# Altium project 8 step seq SMT.PrjPcb
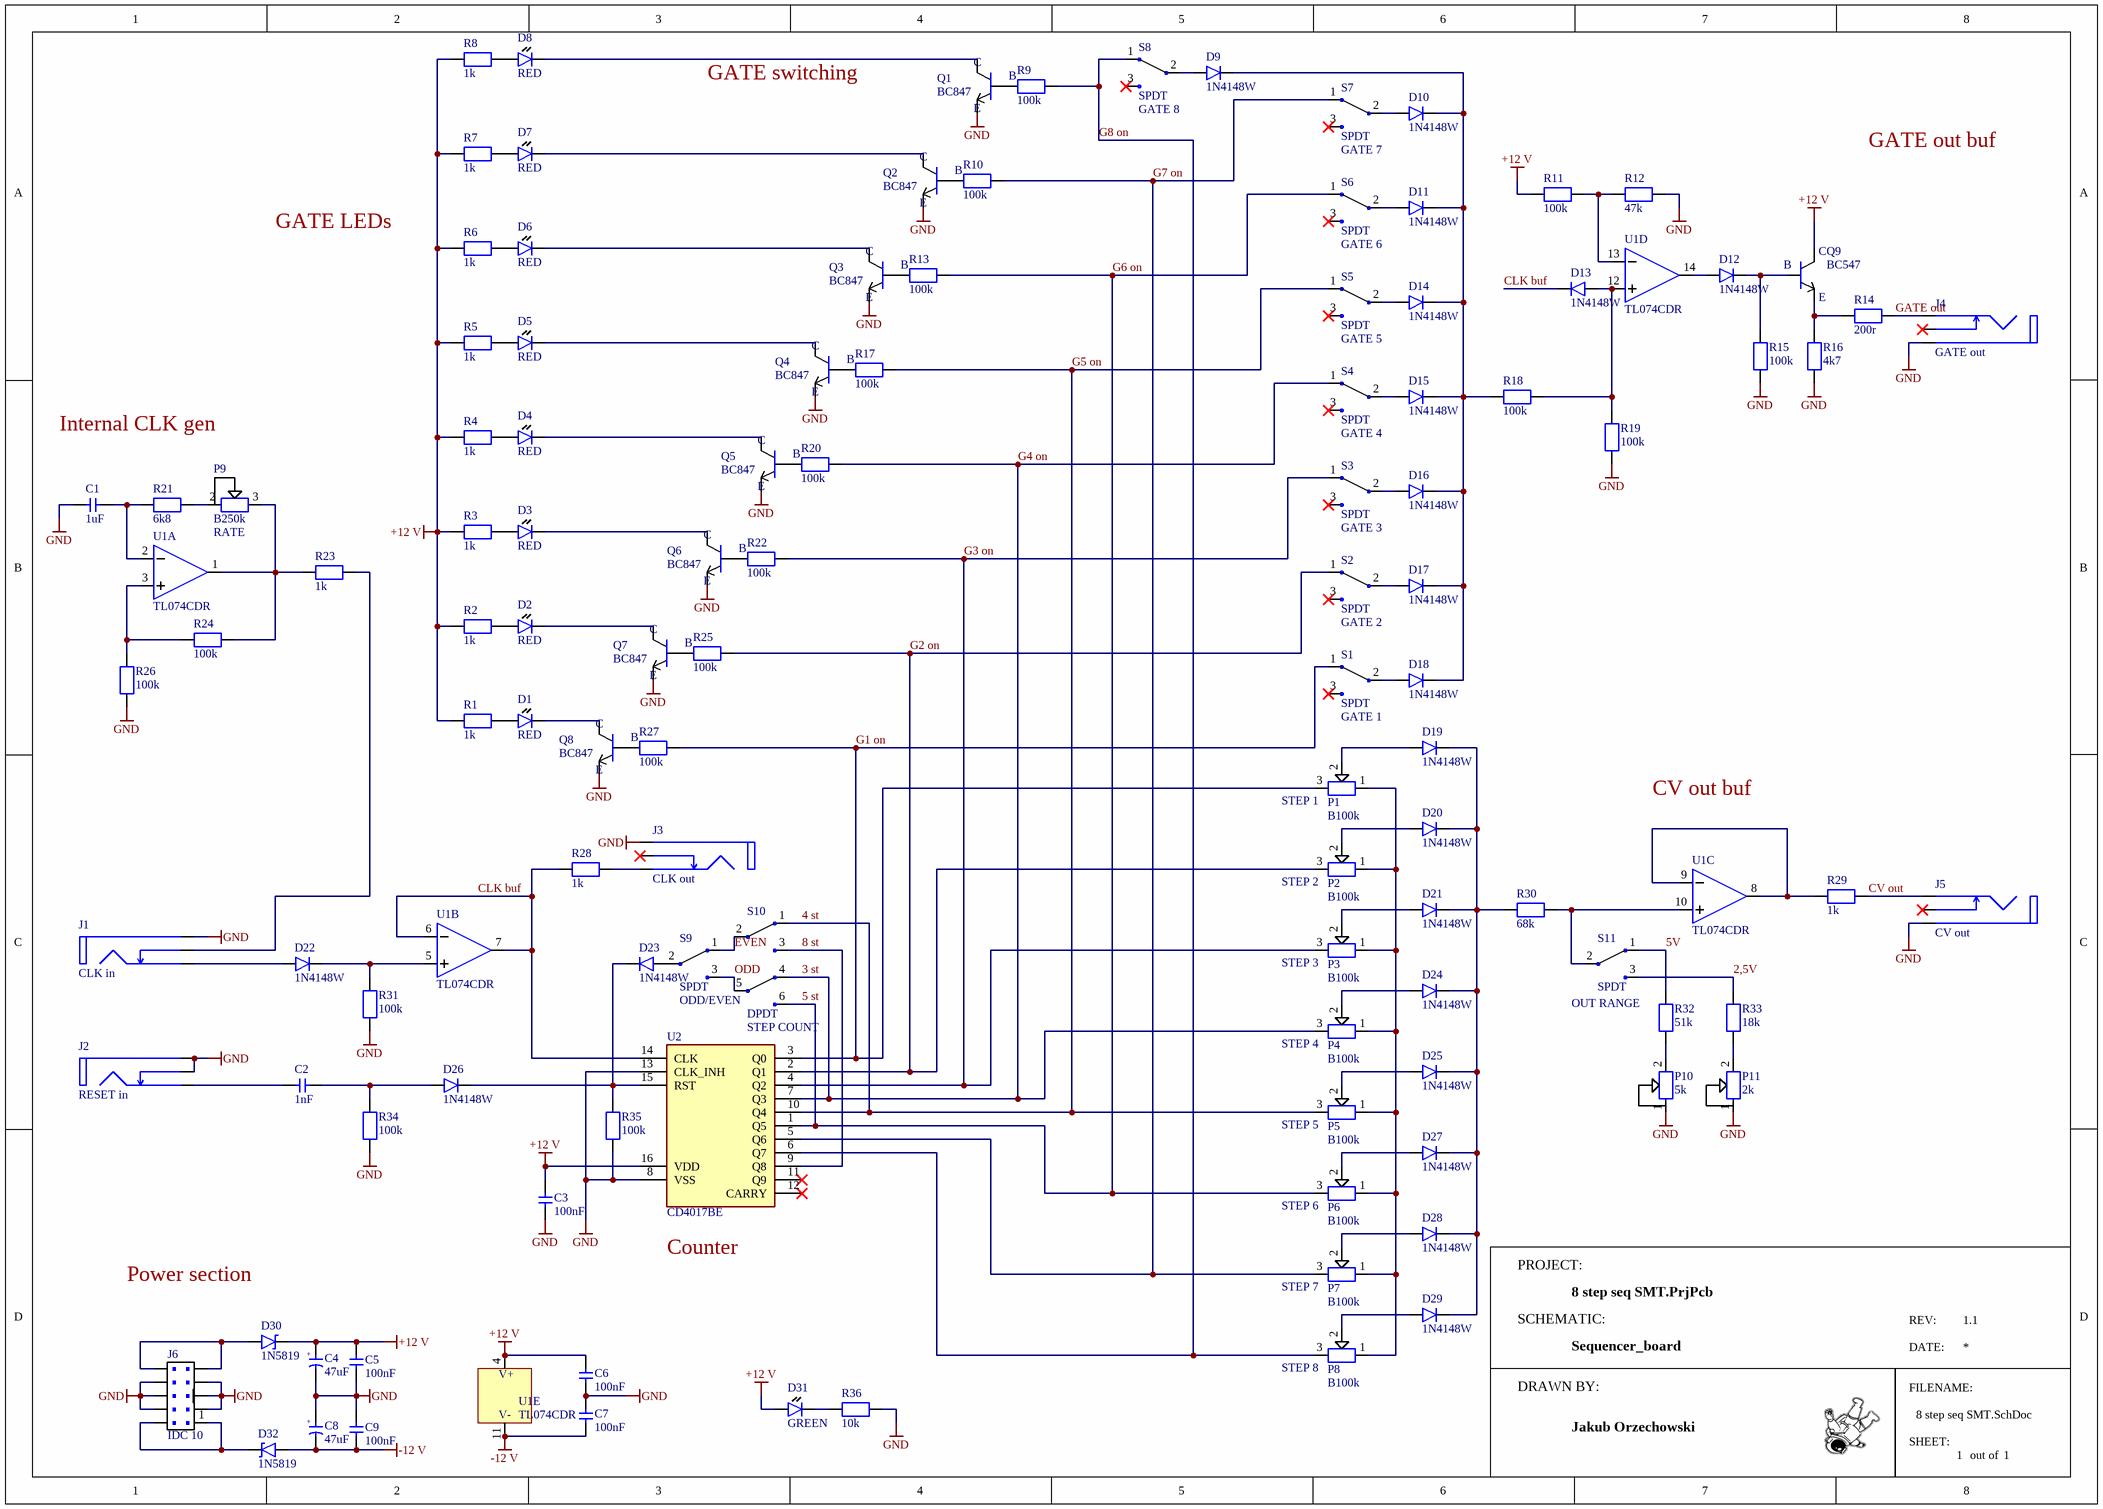
[diagram p0: 8 step seq SMT.SchDoc]
1 sheet, 116 parts. Net scope: global (net labels, ports and power ports of the same name join across sheets).
Board file: 8 step seq SMT.PcbDoc

## Sheet 8 step seq SMT.SchDoc: Sequencer_board
size A3; Author: Jakub Orzechowski; DrawnBy: Jakub Orzechowski; Engineer: aa; Revision: 1.1; SheetNumber: 1; SheetTotal: 1

### Parts
C1  value 1uF  [Cap SMD 0805]  (hidden comment: CAP)
C2  value 1nF  [Cap SMD 0805]  (hidden comment: CAP)
C3  value 100nF  [Cap SMD 0805]  (hidden comment: CAP)
C4  value 47uF  [Cap electrolytic THT 5mm]  (hidden comment: CAP)
C5  value 100nF  [Cap SMD 0805]  (hidden comment: CAP)
C6  value 100nF  [Cap SMD 0805]  (hidden comment: CAP)
C7  value 100nF  [Cap SMD 0805]  (hidden comment: CAP)
C8  value 47uF  [Cap electrolytic THT 5mm]  (hidden comment: CAP)
C9  value 100nF  [Cap SMD 0805]  (hidden comment: CAP)
D1  Color: RED  [LED THT 3 mm raised]  (hidden comment: LED)
D2  Color: RED  [LED THT 3 mm raised]  (hidden comment: LED)
D3  Color: RED  [LED THT 3 mm raised]  (hidden comment: LED)
D4  Color: RED  [LED THT 3 mm raised]  (hidden comment: LED)
D5  Color: RED  [LED THT 3 mm raised]  (hidden comment: LED)
D6  Color: RED  [LED THT 3 mm raised]  (hidden comment: LED)
D7  Color: RED  [LED THT 3 mm raised]  (hidden comment: LED)
D8  Color: RED  [LED THT 3 mm raised]  (hidden comment: LED)
D9  DIODE  [SOD-123]  (value not drawn)
D10  DIODE  [SOD-123]  (value not drawn)
D11  DIODE  [SOD-123]  (value not drawn)
D12  DIODE  [SOD-123]  (value not drawn)
D13  DIODE  [SOD-123]  (value not drawn)
D14  DIODE  [SOD-123]  (value not drawn)
D15  DIODE  [SOD-123]  (value not drawn)
D16  DIODE  [SOD-123]  (value not drawn)
D17  DIODE  [SOD-123]  (value not drawn)
D18  DIODE  [SOD-123]  (value not drawn)
D19  DIODE  [SOD-123]  (value not drawn)
D20  DIODE  [SOD-123]  (value not drawn)
D21  DIODE  [SOD-123]  (value not drawn)
D22  DIODE  [SOD-123]  (value not drawn)
D23  DIODE  [SOD-123]  (value not drawn)
D24  DIODE  [SOD-123]  (value not drawn)
D25  DIODE  [SOD-123]  (value not drawn)
D26  DIODE  [SOD-123]  (value not drawn)
D27  DIODE  [SOD-123]  (value not drawn)
D28  DIODE  [SOD-123]  (value not drawn)
D29  DIODE  [SOD-123]  (value not drawn)
D30  Model: 1N5819  [Diode THT 10 mm]  (hidden comment: SCHOTTKY)
D31  Color: GREEN  [LED SMD 0805]  (hidden comment: LED)
D32  Model: 1N5819  [Diode THT 10 mm]  (hidden comment: SCHOTTKY)
J1  Label: CLK in  [PJ301M]  (hidden comment: JACK Mono)
J2  Label: RESET in  [PJ301M]  (hidden comment: JACK Mono)
J3  Label: CLK out  [PJ301M]  (hidden comment: JACK Mono)
J4  Label: GATE out  [PJ301M]  (hidden comment: JACK Mono)
J5  Label: CV out  [PJ301M]  (hidden comment: JACK Mono)
J6  IDC 10  [IDC 10 PIN]
P1  value B100k  Parameter: STEP 1  [9 mm PCB Potentiometer]  (hidden comment: Mono Pot)
P2  value B100k  Parameter: STEP 2  [9 mm PCB Potentiometer]  (hidden comment: Mono Pot)
P3  value B100k  Parameter: STEP 3  [9 mm PCB Potentiometer]  (hidden comment: Mono Pot)
P4  value B100k  Parameter: STEP 4  [9 mm PCB Potentiometer]  (hidden comment: Mono Pot)
P5  value B100k  Parameter: STEP 5  [9 mm PCB Potentiometer]  (hidden comment: Mono Pot)
P6  value B100k  Parameter: STEP 6  [9 mm PCB Potentiometer]  (hidden comment: Mono Pot)
P7  value B100k  Parameter: STEP 7  [9 mm PCB Potentiometer]  (hidden comment: Mono Pot)
P8  value B100k  Parameter: STEP 8  [9 mm PCB Potentiometer]  (hidden comment: Mono Pot)
P9  value B250k  Parameter: RATE  [9 mm PCB Potentiometer]  (hidden comment: VR)
P10  value 5k  [Multiturn Potentiometer inline]  (hidden comment: VR)
P11  value 2k  [Multiturn Potentiometer inline]  (hidden comment: VR)
Q1  BC847  [SOT-23-3]
Q2  BC847  [SOT-23-3]
Q3  BC847  [SOT-23-3]
Q4  BC847  [SOT-23-3]
Q5  BC847  [SOT-23-3]
Q6  BC847  [SOT-23-3]
Q7  BC847  [SOT-23-3]
Q8  BC847  [SOT-23-3]
Q9  BC547  [TO-92 wide]
R1  value 1k  [Resistor SMD 0805]  (hidden comment: RES)
R2  value 1k  [Resistor SMD 0805]  (hidden comment: RES)
R3  value 1k  [Resistor SMD 0805]  (hidden comment: RES)
R4  value 1k  [Resistor SMD 0805]  (hidden comment: RES)
R5  value 1k  [Resistor SMD 0805]  (hidden comment: RES)
R6  value 1k  [Resistor SMD 0805]  (hidden comment: RES)
R7  value 1k  [Resistor SMD 0805]  (hidden comment: RES)
R8  value 1k  [Resistor SMD 0805]  (hidden comment: RES)
R9  value 100k  [Resistor SMD 0805]  (hidden comment: RES)
R10  value 100k  [Resistor SMD 0805]  (hidden comment: RES)
R11  value 100k  [Resistor SMD 0805]  (hidden comment: RES)
R12  value 47k  [Resistor SMD 0805]  (hidden comment: RES)
R13  value 100k  [Resistor SMD 0805]  (hidden comment: RES)
R14  value 200r  [Resistor SMD 0805]  (hidden comment: RES)
R15  value 100k  [Resistor SMD 0805]  (hidden comment: RES)
R16  value 4k7  [Resistor SMD 0805]  (hidden comment: RES)
R17  value 100k  [Resistor SMD 0805]  (hidden comment: RES)
R18  value 100k  [Resistor SMD 0805]  (hidden comment: RES)
R19  value 100k  [Resistor SMD 0805]  (hidden comment: RES)
R20  value 100k  [Resistor SMD 0805]  (hidden comment: RES)
R21  value 6k8  [Resistor THT 10mm]  (hidden comment: RES)
R22  value 100k  [Resistor SMD 0805]  (hidden comment: RES)
R23  value 1k  [Resistor SMD 0805]  (hidden comment: RES)
R24  value 100k  [Resistor SMD 0805]  (hidden comment: RES)
R25  value 100k  [Resistor SMD 0805]  (hidden comment: RES)
R26  value 100k  [Resistor SMD 0805]  (hidden comment: RES)
R27  value 100k  [Resistor SMD 0805]  (hidden comment: RES)
R28  value 1k  [Resistor SMD 0805]  (hidden comment: RES)
R29  value 1k  [Resistor SMD 0805]  (hidden comment: RES)
R30  value 68k  [Resistor SMD 0805]  (hidden comment: RES)
R31  value 100k  [Resistor SMD 0805]  (hidden comment: RES)
R32  value 51k  [Resistor SMD 0805]  (hidden comment: RES)
R33  value 18k  [Resistor SMD 0805]  (hidden comment: RES)
R34  value 100k  [Resistor SMD 0805]  (hidden comment: RES)
R35  value 100k  [Resistor SMD 0805]  (hidden comment: RES)
R36  value 10k  [Resistor SMD 0805]  (hidden comment: RES)
S1  SPDT  Signals: GATE 1  [MTS-102]
S2  SPDT  Signals: GATE 2  [MTS-102]
S3  SPDT  Signals: GATE 3  [MTS-102]
S4  SPDT  Signals: GATE 4  [MTS-102]
S5  SPDT  Signals: GATE 5  [MTS-102]
S6  SPDT  Signals: GATE 6  [MTS-102]
S7  SPDT  Signals: GATE 7  [MTS-102]
S8  SPDT  Signals: GATE 8  [MTS-102]
S9  SPDT  Signals: ODD/EVEN  [MTS-102]
S10  DPDT  Signals: STEP COUNT  [MTS-202]
S11  SPDT  Signals: OUT RANGE  [MTS-102]
U1  TL074CDR  [SOIC14]  (parts A,B,C,D,E of 5)
U2  CD4017BE  [DIP-16 socket]

### Nets
+12 V: C3.2 C4.2 C5.2 C6.2 D30.2 D31.1 Q9.1 R1.2 R2.2 R3.2 R4.2 R5.2 R6.2 R7.2 R8.2 R11.1 U1.4 U2.16(VDD)
-12 V: C7.1 C8.1 C9.1 D32.1 U1.11
GND: C1.1 C3.1 C4.1 C5.1 C6.1 C7.2 C8.2 C9.2 J1.1 J2.1 J2.2 J3.1 J4.1 J5.1 J6.3 J6.4 J6.5 J6.6 J6.7 J6.8 P10.1 P11.1 Q1.2 Q2.2 Q3.2 Q4.2 Q5.2 Q6.2 Q7.2 Q8.2 R12.2 R15.2 R16.2 R19.1 R26.1 R31.1 R34.1 R35.1 R36.2 U2.8(VSS) U2.13(CLK_INH)
2,5V: R33.1 S11.3
3 st: P4.3 R20.2 S4.1 S10.4 U2.7(Q3)  [also labelled G4 on]
4 st: P5.3 R17.2 S5.1 S10.1 U2.10(Q4)  [also labelled G5 on]
5 st: P6.3 R13.2 S6.1 S10.6 U2.1(Q5)  [also labelled G6 on]
5V: R32.1 S11.1
8 st: S10.3 U2.9(Q8)
CLK buf: D13.2 R28.2 U1.6 U1.7 U2.14(CLK)
CV out: J5.3 R29.1
EVEN: S9.1 S10.2
G1 on: P1.3 R27.2 S1.1 U2.3(Q0)
G2 on: P2.3 R25.2 S2.1 U2.2(Q1)
G3 on: P3.3 R22.2 S3.1 U2.4(Q2)
G7 on: P7.3 R10.2 S7.1 U2.5(Q6)
G8 on: P8.3 R9.2 S8.1 U2.6(Q7)
GATE out: J4.3 R14.1
ODD: S9.3 S10.5
NetC1_2: C1.2 R21.1 U1.2
NetC2_1: C2.1 J2.3
NetC2_2: C2.2 D26.1 R34.2
NetD1_1: D1.1 R1.1
NetD1_2: D1.2 Q8.3
NetD2_1: D2.1 R2.1
NetD2_2: D2.2 Q7.3
NetD3_1: D3.1 R3.1
NetD3_2: D3.2 Q6.3
NetD4_1: D4.1 R4.1
NetD4_2: D4.2 Q5.3
NetD5_1: D5.1 R5.1
NetD5_2: D5.2 Q4.3
NetD6_1: D6.1 R6.1
NetD6_2: D6.2 Q3.3
NetD7_1: D7.1 R7.1
NetD7_2: D7.2 Q2.3
NetD8_1: D8.1 R8.1
NetD8_2: D8.2 Q1.3
NetD9_1: D9.1 S8.2
NetD9_2: D9.2 D10.2 D11.2 D14.2 D15.2 D16.2 D17.2 D18.2 R18.1
NetD10_1: D10.1 S7.2
NetD11_1: D11.1 S6.2
NetD12_1: D12.1 U1.14
NetD12_2: D12.2 Q9.2 R15.1
NetD13_1: D13.1 R18.2 R19.2 U1.12
NetD14_1: D14.1 S5.2
NetD15_1: D15.1 S4.2
NetD16_1: D16.1 S3.2
NetD17_1: D17.1 S2.2
NetD18_1: D18.1 S1.2
NetD19_1: D19.1 P1.2
NetD19_2: D19.2 D20.2 D21.2 D24.2 D25.2 D27.2 D28.2 D29.2 R30.2
NetD20_1: D20.1 P2.2
NetD21_1: D21.1 P3.2
NetD22_1: D22.1 J1.3
NetD22_2: D22.2 R31.2 U1.5
NetD23_1: D23.1 S9.2
NetD23_2: D23.2 D26.2 R35.2 U2.15(RST)
NetD24_1: D24.1 P4.2
NetD25_1: D25.1 P5.2
NetD27_1: D27.1 P6.2
NetD28_1: D28.1 P7.2
NetD29_1: D29.1 P8.2
NetD30_1: D30.1 J6.9 J6.10
NetD31_2: D31.2 R36.1
NetD32_2: D32.2 J6.1 J6.2
NetJ1_2: J1.2 R23.2
NetJ3_3: J3.3 R28.1
NetP1_1: P1.1 P2.1 P3.1 P4.1 P5.1 P6.1 P7.1 P8.1
NetP9_2: P9.2 R21.2
NetP9_3: P9.3 R23.1 R24.2 U1.1
NetP10_2: P10.2 R32.2
NetP11_2: P11.2 R33.2
NetQ1_1: Q1.1 R9.1
NetQ2_1: Q2.1 R10.1
NetQ3_1: Q3.1 R13.1
NetQ4_1: Q4.1 R17.1
NetQ5_1: Q5.1 R20.1
NetQ6_1: Q6.1 R22.1
NetQ7_1: Q7.1 R25.1
NetQ8_1: Q8.1 R27.1
NetQ9_3: Q9.3 R14.2 R16.1
NetR11_2: R11.2 R12.1 U1.13
NetR24_1: R24.1 R26.2 U1.3
NetR29_2: R29.2 U1.8 U1.9
NetR30_1: R30.1 S11.2 U1.10

Not connected (* = marked no-connect by the designer): J3 2*; J4 2*; J5 2*; S1 3*; S2 3*; S3 3*; S4 3*; S5 3*; S6 3*; S7 3*; S8 3*; U2 11(Q9)* 12(CARRY)*

### Notes on the sheet
- GATE switching
- GATE out buf
- GATE LEDs
- Internal CLK gen
- CV out buf
- (near U2) Counter
- Power section
- PROJECT:
- SCHEMATIC:
- REV:
- DRAWN BY:
- DATE:
- FILENAME:
- SHEET:
- out of
- (in symbol BC547) C; B; E
- (in symbol BC847) C; B; E
- (in symbol Capacitor Electr THT 5mm) +
- (in symbol TL074CDR SOIC14, part E) V+; V-

### Library data of the parts
C1-C3 C5-C7 C9 = Capacitor SMD 0805: SMD Capacitor Non-Polarised 0805 Package; Voltage rating: *; Tolerance: *; Package Type: SMD
C4 C8 = Capacitor Electr THT 5mm: THT Electrolytic Capacitor 5 mm Diameter; Voltage rating: *; Tolerance: *; Package Type: THT
D1-D8 = LED THT 3mm: THT LED Diode 3 mm Diameter; Forward voltage: *; Package Type: THT; Type: LED
D9-D29 = 1N4148W: 1N4148W SMD Diode SOD123 Package; Max reverse voltage: *; Max current: *; Forward voltage: *; Package Type: SMD; Type: Diode; Model: 1N4148W
D30 D32 = Schottky Diode THT: Generic THT Axial Schottky Diode 10 mm Pitch; Max Reverse Voltage: *; Max Current: *; Package Type: THT; Type: Schottky
D31 = LED SMD: SMD LED Diode 0805 Package; Forward voltage: *; Package Type: SMD; Type: LED
J1-J5 = PJ301M: PJ301M Eurorack 3,5 mm Patch Socket PCB Mount; Package Type: THT
J6 = IDC 10 pin: 10 Pin IDC Connector
P1-P8 = Potentiometer 9 mm: PCB Mount 9mm Mono Potentiometer THT; Taper: *; Package Type: THT; Type: Potentiometer
P9 = VR B 9 mm: PCB Mount 9mm Mono Potentiometer THT as Variable Resistor Clockwise Decrease; Taper: *; Package Type: THT; Type: Potentiometer
P10 P11 = VR A Multiturn THT: PCB Mount Multiturn Trimmer Potentiometer Top Adjustable as Variable Resistor Clockwise Increase; Taper: *; Package Type: THT; Type: Potentiometer; Parameter: *
Q1-Q8 = BC847: BC847 NPN Transistor SMD SOT-23-3 Package; Package Type: SMD; Type: NPN Transistor; Package: SOT-23-3; Group: *
Q9 = BC547: BC547 NPN Transistor THT TO-92 Package; Package Type: THT; Type: NPN Transistor; Package: TO-92; Group: *
R1-R20 R22-R36 = Resistor SMD 0805: SMD Resistor 0805 package; Tolerance: *; Package Type: SMD
R21 = Resistor THT: THT Axial Resistor 10mm Pitch; Tolerance: *; Package Type: THT
S1-S9 S11 = MTS-102: Single Pole Double Throw on-on Switch; Package Type: THT; Type: Switch
S10 = MTS-202: Dual Pole Dual Throw on-on Switch; Package Type: THT; Type: Switch
U1 = TL074CDR SOIC14: TL074CDR Quad Op-Amp SOIC14 Package; Type: Op Amp; Package Type: SMD; Package: SOIC14
U2 = CD4017BE DIP-16: CD4017BE CMOS Decade Counter DIP-16 Package; Type: Counter; Package Type: THT; Package: DIP-16